# EAGLE design Fysetc F6_TMC-Shield_HV (EAGLE 8.6.3)
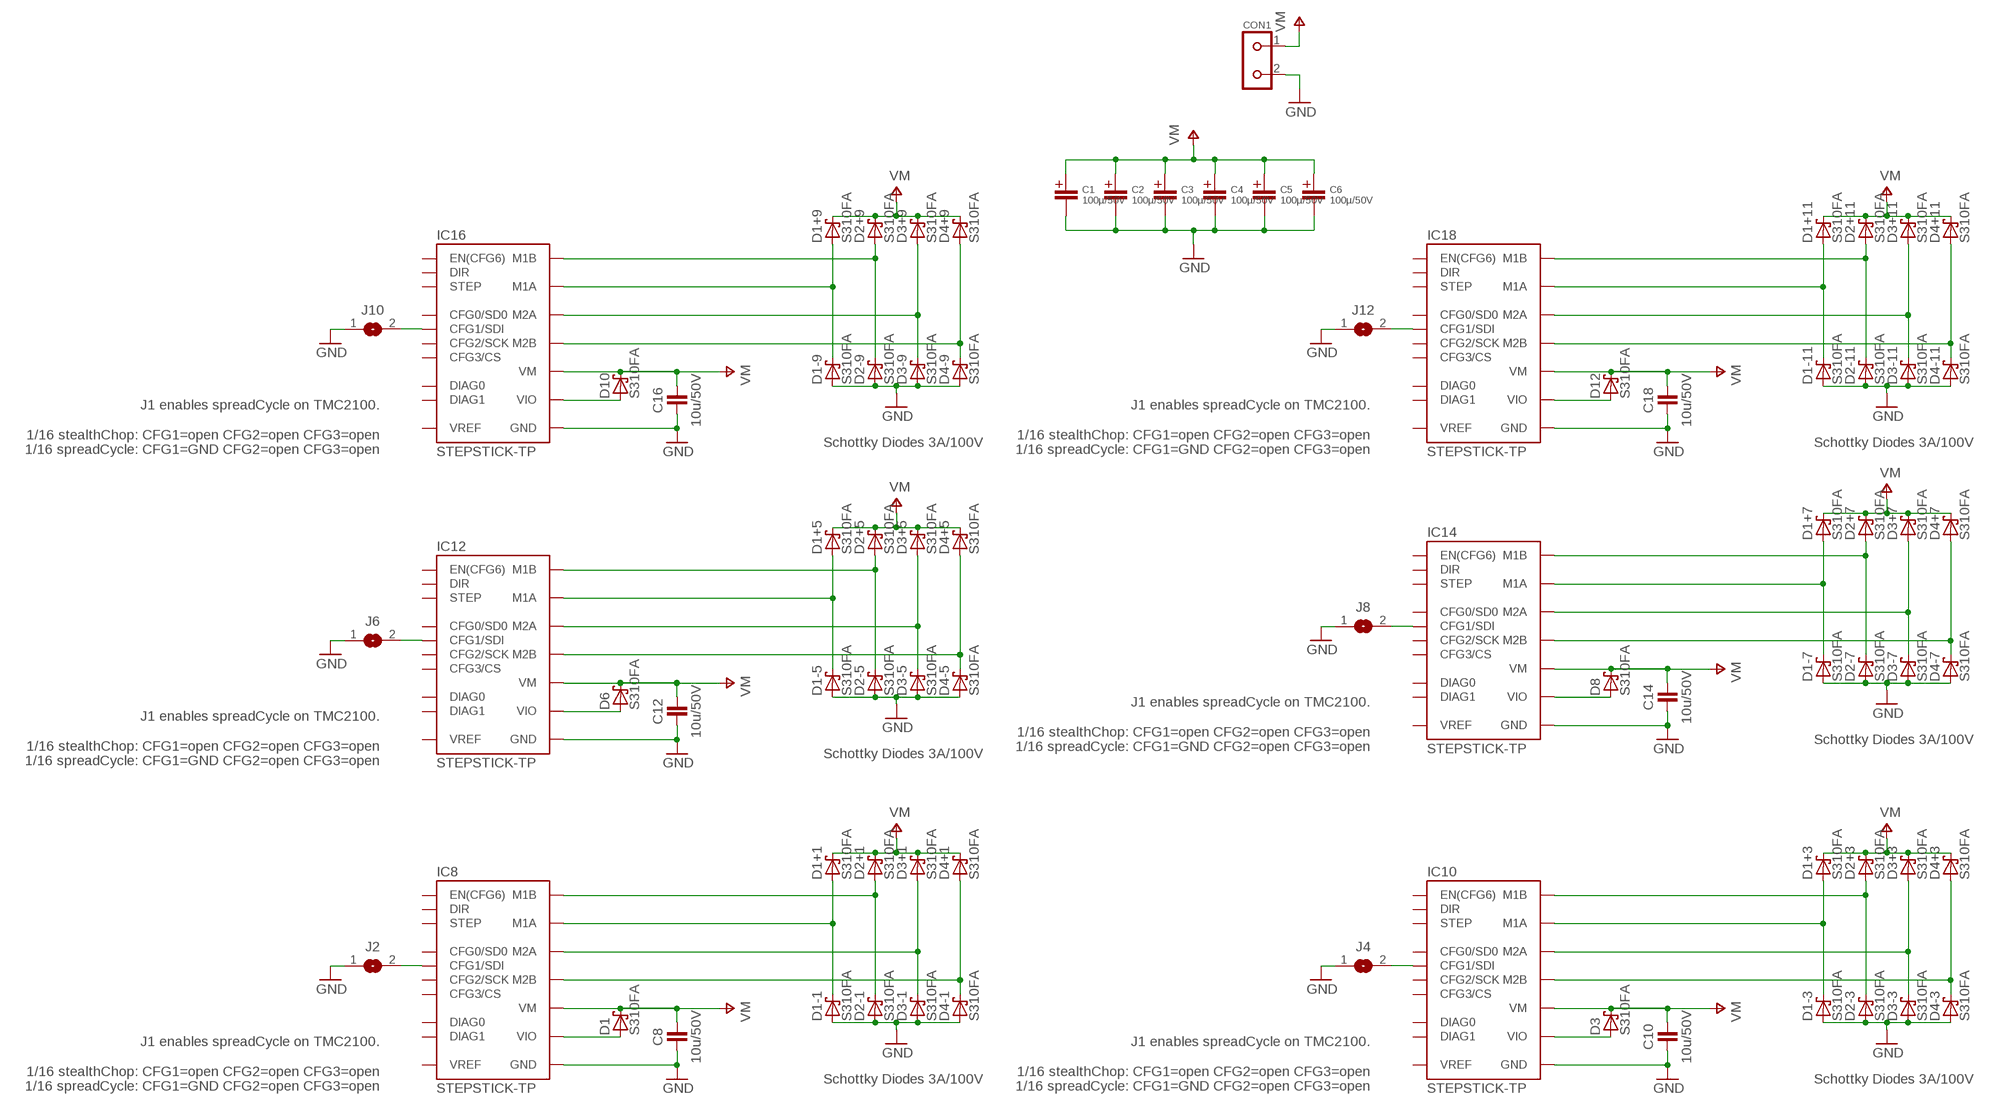
[diagram p0: schematic, sheet 1]

## Parts
C1  100µ/50V  C+3.5/8  [C+/3.5/8]
C2  100µ/50V  C+3.5/8  [C+/3.5/8]
C3  100µ/50V  C+3.5/8  [C+/3.5/8]
C4  100µ/50V  C+3.5/8  [C+/3.5/8]
C5  100µ/50V  C+3.5/8  [C+/3.5/8]
C6  100µ/50V  C+3.5/8  [C+/3.5/8]
C8  10u/50V  CAPACITOR-1210  [C1210]
C10  10u/50V  CAPACITOR-1210  [C1210]
C12  10u/50V  CAPACITOR-1210  [C1210]
C14  10u/50V  CAPACITOR-1210  [C1210]
C16  10u/50V  CAPACITOR-1210  [C1210]
C18  10u/50V  CAPACITOR-1210  [C1210]
CON1  KL2691311500002  [KL2-691311500002]
D1  S310FA  D_SCHOTTKY-SOD123  [SOD123]
D1+1  S310FA  D_SCHOTTKY-SOD123  [SOD123]
D1+3  S310FA  D_SCHOTTKY-SOD123  [SOD123]
D1+5  S310FA  D_SCHOTTKY-SOD123  [SOD123]
D1+7  S310FA  D_SCHOTTKY-SOD123  [SOD123]
D1+9  S310FA  D_SCHOTTKY-SOD123  [SOD123]
D1+11  S310FA  D_SCHOTTKY-SOD123  [SOD123]
D1-1  S310FA  D_SCHOTTKY-SOD123  [SOD123]
D1-3  S310FA  D_SCHOTTKY-SOD123  [SOD123]
D1-5  S310FA  D_SCHOTTKY-SOD123  [SOD123]
D1-7  S310FA  D_SCHOTTKY-SOD123  [SOD123]
D1-9  S310FA  D_SCHOTTKY-SOD123  [SOD123]
D1-11  S310FA  D_SCHOTTKY-SOD123  [SOD123]
D2+1  S310FA  D_SCHOTTKY-SOD123  [SOD123]
D2+3  S310FA  D_SCHOTTKY-SOD123  [SOD123]
D2+5  S310FA  D_SCHOTTKY-SOD123  [SOD123]
D2+7  S310FA  D_SCHOTTKY-SOD123  [SOD123]
D2+9  S310FA  D_SCHOTTKY-SOD123  [SOD123]
D2+11  S310FA  D_SCHOTTKY-SOD123  [SOD123]
D2-1  S310FA  D_SCHOTTKY-SOD123  [SOD123]
D2-3  S310FA  D_SCHOTTKY-SOD123  [SOD123]
D2-5  S310FA  D_SCHOTTKY-SOD123  [SOD123]
D2-7  S310FA  D_SCHOTTKY-SOD123  [SOD123]
D2-9  S310FA  D_SCHOTTKY-SOD123  [SOD123]
D2-11  S310FA  D_SCHOTTKY-SOD123  [SOD123]
D3  S310FA  D_SCHOTTKY-SOD123  [SOD123]
D3+1  S310FA  D_SCHOTTKY-SOD123  [SOD123]
D3+3  S310FA  D_SCHOTTKY-SOD123  [SOD123]
D3+5  S310FA  D_SCHOTTKY-SOD123  [SOD123]
D3+7  S310FA  D_SCHOTTKY-SOD123  [SOD123]
D3+9  S310FA  D_SCHOTTKY-SOD123  [SOD123]
D3+11  S310FA  D_SCHOTTKY-SOD123  [SOD123]
D3-1  S310FA  D_SCHOTTKY-SOD123  [SOD123]
D3-3  S310FA  D_SCHOTTKY-SOD123  [SOD123]
D3-5  S310FA  D_SCHOTTKY-SOD123  [SOD123]
D3-7  S310FA  D_SCHOTTKY-SOD123  [SOD123]
D3-9  S310FA  D_SCHOTTKY-SOD123  [SOD123]
D3-11  S310FA  D_SCHOTTKY-SOD123  [SOD123]
D4+1  S310FA  D_SCHOTTKY-SOD123  [SOD123]
D4+3  S310FA  D_SCHOTTKY-SOD123  [SOD123]
D4+5  S310FA  D_SCHOTTKY-SOD123  [SOD123]
D4+7  S310FA  D_SCHOTTKY-SOD123  [SOD123]
D4+9  S310FA  D_SCHOTTKY-SOD123  [SOD123]
D4+11  S310FA  D_SCHOTTKY-SOD123  [SOD123]
D4-1  S310FA  D_SCHOTTKY-SOD123  [SOD123]
D4-3  S310FA  D_SCHOTTKY-SOD123  [SOD123]
D4-5  S310FA  D_SCHOTTKY-SOD123  [SOD123]
D4-7  S310FA  D_SCHOTTKY-SOD123  [SOD123]
D4-9  S310FA  D_SCHOTTKY-SOD123  [SOD123]
D4-11  S310FA  D_SCHOTTKY-SOD123  [SOD123]
D6  S310FA  D_SCHOTTKY-SOD123  [SOD123]
D8  S310FA  D_SCHOTTKY-SOD123  [SOD123]
D10  S310FA  D_SCHOTTKY-SOD123  [SOD123]
D12  S310FA  D_SCHOTTKY-SOD123  [SOD123]
IC8  STEPSTICK-TP  [STEPSTICK_TP]
IC10  STEPSTICK-TP  [STEPSTICK_TP]
IC12  STEPSTICK-TP  [STEPSTICK_TP]
IC14  STEPSTICK-TP  [STEPSTICK_TP]
IC16  STEPSTICK-TP  [STEPSTICK_TP]
IC18  STEPSTICK-TP  [STEPSTICK_TP]
J2  JUMPER2-0603-NC  [JUMPER2-0603_NC]
J4  JUMPER2-0603-NC  [JUMPER2-0603_NC]
J6  JUMPER2-0603-NC  [JUMPER2-0603_NC]
J8  JUMPER2-0603-NC  [JUMPER2-0603_NC]
J10  JUMPER2-0603-NC  [JUMPER2-0603_NC]
J12  JUMPER2-0603-NC  [JUMPER2-0603_NC]

## Nets
GND: C1.- C2.- C3.- C4.- C5.- C6.- C8.1 C10.1 C12.1 C14.1 C16.1 C18.1 CON1.2 D1-1.A D1-3.A D1-5.A D1-7.A D1-9.A D1-11.A D2-1.A D2-3.A D2-5.A D2-7.A D2-9.A D2-11.A D3-1.A D3-3.A D3-5.A D3-7.A D3-9.A D3-11.A D4-1.A D4-3.A D4-5.A D4-7.A D4-9.A D4-11.A IC8.GND@1(GND) IC8.GND@2(GND) IC10.GND@1(GND) IC10.GND@2(GND) IC12.GND@1(GND) IC12.GND@2(GND) IC14.GND@1(GND) IC14.GND@2(GND) IC16.GND@1(GND) IC16.GND@2(GND) IC18.GND@1(GND) IC18.GND@2(GND) J2.1 J4.1 J6.1 J8.1 J10.1 J12.1
M1A1: D1+1.A D1-1.C IC8.M1A
M1A3: D1+3.A D1-3.C IC10.M1A
M1A5: D1+5.A D1-5.C IC12.M1A
M1A7: D1+7.A D1-7.C IC14.M1A
M1A9: D1+9.A D1-9.C IC16.M1A
M1A11: D1+11.A D1-11.C IC18.M1A
M1B1: D2+1.A D2-1.C IC8.M1B
M1B3: D2+3.A D2-3.C IC10.M1B
M1B5: D2+5.A D2-5.C IC12.M1B
M1B7: D2+7.A D2-7.C IC14.M1B
M1B9: D2+9.A D2-9.C IC16.M1B
M1B11: D2+11.A D2-11.C IC18.M1B
M2A1: D3+1.A D3-1.C IC8.M2A
M2A3: D3+3.A D3-3.C IC10.M2A
M2A5: D3+5.A D3-5.C IC12.M2A
M2A7: D3+7.A D3-7.C IC14.M2A
M2A9: D3+9.A D3-9.C IC16.M2A
M2A11: D3+11.A D3-11.C IC18.M2A
M2B1: D4+1.A D4-1.C IC8.M2B
M2B3: D4+3.A D4-3.C IC10.M2B
M2B5: D4+5.A D4-5.C IC12.M2B
M2B7: D4+7.A D4-7.C IC14.M2B
M2B9: D4+9.A D4-9.C IC16.M2B
M2B11: D4+11.A D4-11.C IC18.M2B
N$2: IC8.CFG1(CFG1/SDI) J2.2
N$4: IC10.CFG1(CFG1/SDI) J4.2
N$6: IC12.CFG1(CFG1/SDI) J6.2
N$8: IC14.CFG1(CFG1/SDI) J8.2
N$10: IC16.CFG1(CFG1/SDI) J10.2
N$12: IC18.CFG1(CFG1/SDI) J12.2
VIO1: D1.A IC8.VIO
VIO3: D3.A IC10.VIO
VIO5: D6.A IC12.VIO
VIO7: D8.A IC14.VIO
VIO9: D10.A IC16.VIO
VIO11: D12.A IC18.VIO
VM: C1.+ C2.+ C3.+ C4.+ C5.+ C6.+ C8.2 C10.2 C12.2 C14.2 C16.2 C18.2 CON1.1 D1+1.C D1+3.C D1+5.C D1+7.C D1+9.C D1+11.C D1.C D2+1.C D2+3.C D2+5.C D2+7.C D2+9.C D2+11.C D3+1.C D3+3.C D3+5.C D3+7.C D3+9.C D3+11.C D3.C D4+1.C D4+3.C D4+5.C D4+7.C D4+9.C D4+11.C D6.C D8.C D10.C D12.C IC8.VM IC10.VM IC12.VM IC14.VM IC16.VM IC18.VM
Unconnected: IC8.CFG2(CFG2/SCK) IC8.CFG3(CFG3/CS) IC8.DIAG0 IC8.DIAG1 IC8.DIR IC8.EN(EN(CFG6)) IC8.NC/CFG0(CFG0/SD0) IC8.STEP IC8.VREF IC10.CFG2(CFG2/SCK) IC10.CFG3(CFG3/CS) IC10.DIAG0 IC10.DIAG1 IC10.DIR IC10.EN(EN(CFG6)) IC10.NC/CFG0(CFG0/SD0) IC10.STEP IC10.VREF IC12.CFG2(CFG2/SCK) IC12.CFG3(CFG3/CS) IC12.DIAG0 IC12.DIAG1 IC12.DIR IC12.EN(EN(CFG6)) IC12.NC/CFG0(CFG0/SD0) IC12.STEP IC12.VREF IC14.CFG2(CFG2/SCK) IC14.CFG3(CFG3/CS) IC14.DIAG0 IC14.DIAG1 IC14.DIR IC14.EN(EN(CFG6)) IC14.NC/CFG0(CFG0/SD0) IC14.STEP IC14.VREF IC16.CFG2(CFG2/SCK) IC16.CFG3(CFG3/CS) IC16.DIAG0 IC16.DIAG1 IC16.DIR IC16.EN(EN(CFG6)) IC16.NC/CFG0(CFG0/SD0) IC16.STEP IC16.VREF IC18.CFG2(CFG2/SCK) IC18.CFG3(CFG3/CS) IC18.DIAG0 IC18.DIAG1 IC18.DIR IC18.EN(EN(CFG6)) IC18.NC/CFG0(CFG0/SD0) IC18.STEP IC18.VREF

## Notes on the sheet
- J1 enables spreadCycle on TMC2100.
  
  1/16 stealthChop: CFG1=open CFG2=open CFG3=open
  1/16 spreadCycle: CFG1=GND CFG2=open CFG3=open
- J1 enables spreadCycle on TMC2100.
  
  1/16 stealthChop: CFG1=open CFG2=open CFG3=open
  1/16 spreadCycle: CFG1=GND CFG2=open CFG3=open
- Schottky Diodes 3A/100V | Schottky Diodes 3A/100V
- J1 enables spreadCycle on TMC2100.
  
  1/16 stealthChop: CFG1=open CFG2=open CFG3=open
  1/16 spreadCycle: CFG1=GND CFG2=open CFG3=open
- J1 enables spreadCycle on TMC2100.
  
  1/16 stealthChop: CFG1=open CFG2=open CFG3=open
  1/16 spreadCycle: CFG1=GND CFG2=open CFG3=open
- Schottky Diodes 3A/100V
- Schottky Diodes 3A/100V
- J1 enables spreadCycle on TMC2100.
  
  1/16 stealthChop: CFG1=open CFG2=open CFG3=open
  1/16 spreadCycle: CFG1=GND CFG2=open CFG3=open
- J1 enables spreadCycle on TMC2100.
  
  1/16 stealthChop: CFG1=open CFG2=open CFG3=open
  1/16 spreadCycle: CFG1=GND CFG2=open CFG3=open
- Schottky Diodes 3A/100V | Schottky Diodes 3A/100V

## Library data of the parts
C1-C6 = goujine:C+
C8 C10 C12 C14 C16 C18 = we-rcl:CAPACITOR: Capacitors ...2.2uF @ 6.3V -> 0402 ...4.7uF @ 6.3V -> 0603 ...10uF @ 16V -> 0805 ...22uF @ 25V -> 1206
CON1 = neumluc:KL2: Printklemme 2-polig
D1 D1+1 D1+3 D1+5 D1+7 D1+9 D1+11 D1-1 D1-3 D1-5 D1-7 D1-9 D1-11 D2+1 D2+3 D2+5 D2+7 D2+9 D2+11 D2-1 D2-3 D2-5 D2-7 D2-9 D2-11 D3 D3+1 D3+3 D3+5 D3+7 D3+9 D3+11 D3-1 D3-3 D3-5 D3-7 D3-9 D3-11 D4+1 D4+3 D4+5 D4+7 D4+9 D4+11 D4-1 D4-3 D4-5 D4-7 D4-9 D4-11 D6 D8 D10 D12 = we-rcl:D_SCHOTTKY: Schottky Diodes 1A, 30V - SOD323 (BAS3010 or CUS10S40) 2A, 30V - SMA/DO214AC 10A,45V - Z5-T (CDBZ5T1045)
IC8 IC10 IC12 IC14 IC16 IC18 = we-board:STEPSTICK: SilentStepStick - Trinamic TMC2100/TMC2130 Stepper Motor Driver TMC2100 - CFG pins for configuration TMC2130 - SPI for configuration Pin CFG0/SDO only available on TMC2130 SilentStepStick.
J2 J4 J6 J8 J10 J12 = we-rcl:JUMPER2: 2 Pin Jumpers

## Board
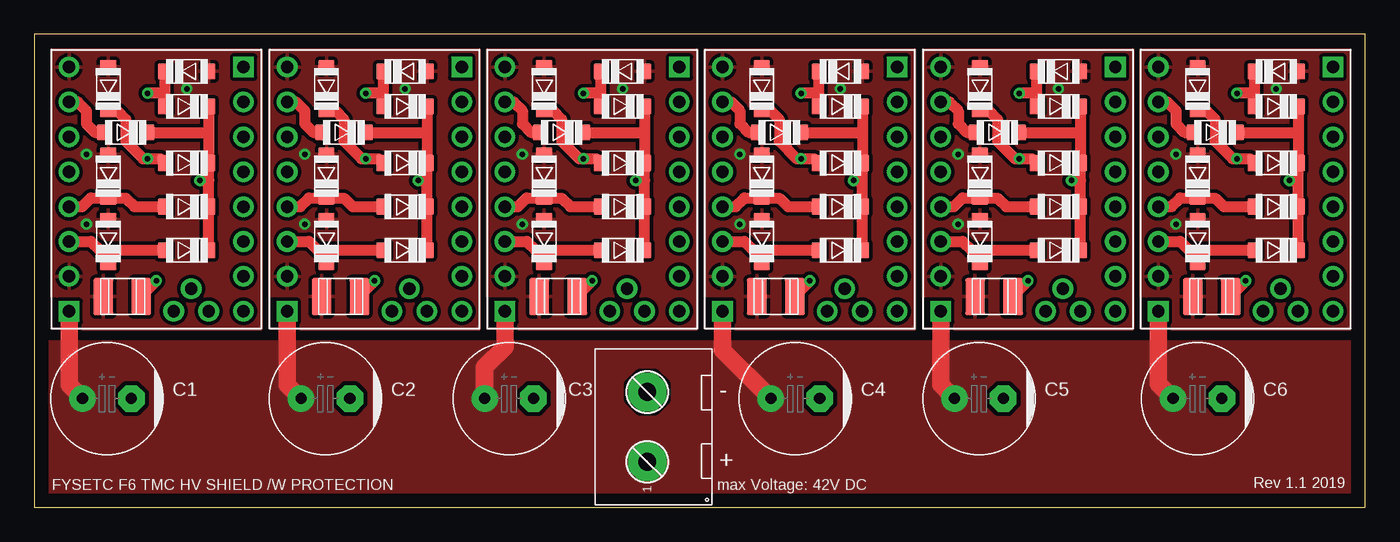
[diagram p1: board, top side]
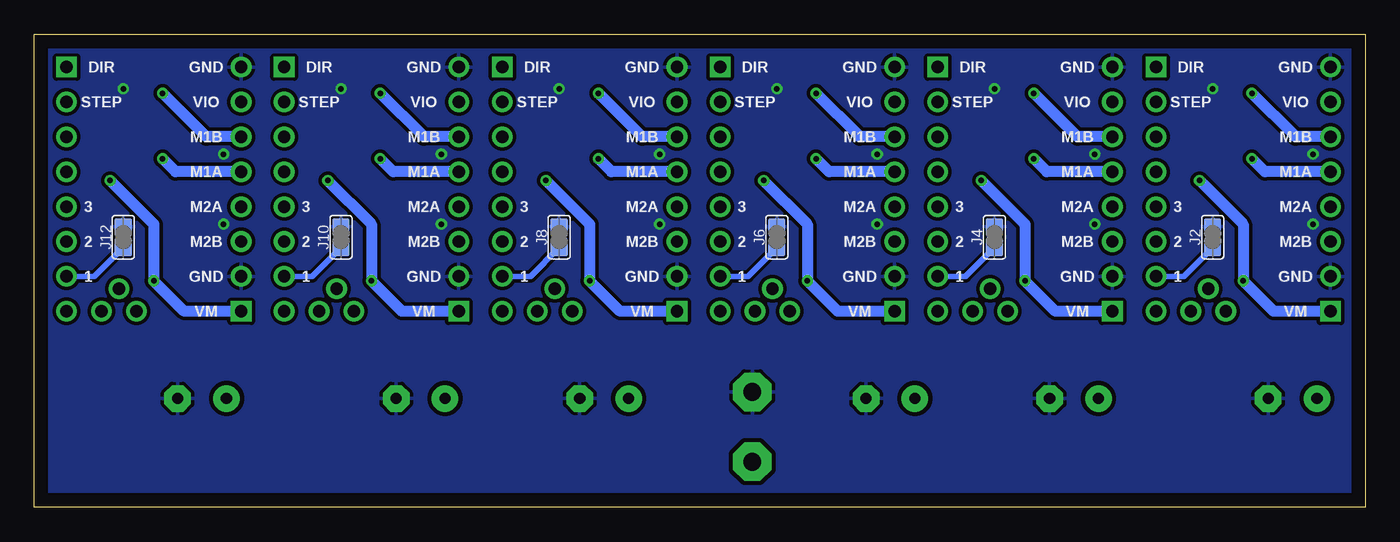
[diagram p2: board, bottom side, seen from below]

Size 96.82 x 34.44 mm. Coordinates in mm from the lower left corner, seen from the top.
Outline: 96.82,34.44 0,34.44 0,0 96.82,0 96.82,34.44
Copper layers (1*16): Top 0.035mm / dielectric 1.5mm / Bottom 0.035mm
Design rules "default": minimum track width 6mil, minimum drill 0.35mm, track to track 6mil, track to pad 6mil, pad to pad 6mil, via to via 6mil, smd to smd 6mil, copper to edge 40mil, drill to drill 6mil, minimum pad ring 10mil, minimum via ring 8mil, stop-mask expansion 4mil, vias tented up to drill 0mil, thermal gap 10mil
tRestrict: area 1.1,13 to 1.6,14.9; area 17.1,13 to 17.4,14.9; area 33,13 to 33.3,14.9; area 48.9,13 to 49.2,14.9; area 64.6,13 to 65.1,14.9; area 80.5,13 to 80.8,14.9

### Footprints (pad centres in the part's own frame; a part is rotated, then mirrored left to right if it is on the bottom)
C+/3.5/8 = drill 0.813 pad 1.93: + -1.778,0 | drill 0.813 pad 1.93 octagon: - 1.778,0
C1210 = smd 2.7 x 1.45: 1 0,1.4; 2 0,-1.35
KL2-691311500002 = drill 1.3 pad 2.8 octagon: 1 -2.54,0; 2 2.54,0
SOD123 = smd 1.2 x 1: A 0,-1.6; C 0,1.6
STEPSTICK_TP = drill 0.9 pad 1.5: CFG1 -6.35,6.35; CFG2 -6.35,3.81; CFG3 -6.35,1.27; DIAG0 -2.54,7.239; DIAG1 -1.27,8.89; EN -6.35,8.89; GND@1 6.35,6.35; GND@2 6.35,-8.89; M1A 6.35,-1.27; M1B 6.35,-3.81; M2A 6.35,1.27; M2B 6.35,3.81; NC -6.35,-3.81; NC/CFG0 -6.35,-1.27; STEP -6.35,-6.35; VIO 6.35,-6.35; VREF -3.81,8.89 | drill 0.9 pad 1.5 square: DIR -6.35,-8.89; VM 6.35,8.89
JUMPER2-0603_NC = smd 1.25 x 1.25: 1 0,0.76; 2 0,-0.76

### Placement (x,y rotation side)
C1  5.28,7.92 0 top
C2  21.18,7.92 0 top
C3  34.54,7.92 0 top
C4  55.36,7.92 0 top
C5  68.72,7.92 0 top
C6  84.62,7.92 0 top
C8  6.42,15.35 90 top
C10  22.3,15.35 90 top
C12  38.13,15.35 90 top
C14  53.97,15.35 90 top
C16  69.84,15.35 90 top
C18  85.68,15.35 90 top
CON1  44.59,5.86 90 top
D1  6.65,27.29 270 top
D1+1  11.09,25.07 270 top
D1+3  26.97,25.07 270 top
D1+5  42.8,25.07 270 top
D1+7  58.64,25.07 270 top
D1+9  74.51,25.07 270 top
D1+11  90.35,25.07 270 top
D1-1  5.38,30.47 180 top
D1-3  21.25,30.47 180 top
D1-5  37.09,30.47 180 top
D1-7  52.92,30.47 180 top
D1-9  68.8,30.47 180 top
D1-11  84.63,30.47 180 top
D2+1  11.09,29.2 270 top
D2+3  26.97,29.2 270 top
D2+5  42.8,29.2 270 top
D2+7  58.64,29.2 270 top
D2+9  74.51,29.2 270 top
D2+11  90.35,29.2 270 top
D2-1  11.09,31.74 90 top
D2-3  26.97,31.74 90 top
D2-5  42.8,31.74 90 top
D2-7  58.64,31.74 90 top
D2-9  74.51,31.74 90 top
D2-11  90.35,31.74 90 top
D3  22.52,27.29 270 top
D3+1  11.09,21.89 270 top
D3+3  26.97,21.89 270 top
D3+5  42.8,21.89 270 top
D3+7  58.64,21.89 270 top
D3+9  74.51,21.89 270 top
D3+11  90.35,21.89 270 top
D3-1  5.38,24.12 180 top
D3-3  21.25,24.12 180 top
D3-5  37.09,24.12 180 top
D3-7  52.92,24.12 180 top
D3-9  68.8,24.12 180 top
D3-11  84.63,24.12 180 top
D4+1  11.09,18.72 270 top
D4+3  26.97,18.72 270 top
D4+5  42.8,18.72 270 top
D4+7  58.64,18.72 270 top
D4+9  74.51,18.72 270 top
D4+11  90.35,18.72 270 top
D4-1  5.38,19.36 180 top
D4-3  21.25,19.36 180 top
D4-5  37.09,19.36 180 top
D4-7  52.92,19.36 180 top
D4-9  68.8,19.36 180 top
D4-11  84.63,19.36 180 top
D6  38.36,27.29 270 top
D8  54.19,27.29 270 top
D10  70.07,27.29 270 top
D12  85.9,27.29 270 top
IC8  8.87,23.16 180 top
IC10  24.75,23.16 180 top
IC12  40.58,23.16 180 top
IC14  56.42,23.16 180 top
IC16  72.29,23.16 180 top
IC18  88.13,23.16 180 top
J2  11.09,19.67 0 bottom
J4  26.97,19.67 0 bottom
J6  42.8,19.67 0 bottom
J8  58.64,19.67 0 bottom
J10  74.51,19.67 0 bottom
J12  90.35,19.67 0 bottom

### Tracks (layer width: path | path; a pad name or v marks a point on that pad's centre or on a via)
GND  (via drill 0.4)
  other vias: 11.09,30.47 3.79,20.62 3.79,25.71 26.97,30.47 19.66,20.62 19.66,25.71 42.8,30.47 35.5,20.62 35.5,25.71 58.64,30.47 51.34,20.62 51.34,25.71 74.51,30.47 67.21,20.62 67.21,25.71 90.35,30.47 83.05,20.62 83.05,25.71
  pour Bottom (isolate 0.254): 1.25,13.01 16.49,13.01 16.49,33.32 1.25,33.32
  pour Top (isolate 0.254): 1.25,13.01 16.49,13.01 16.49,33.32 1.25,33.32
  pour Bottom (isolate 0.254): 17.12,13.01 32.36,13.01 32.36,33.32 17.12,33.32
  pour Top (isolate 0.254): 17.12,13.01 32.36,13.01 32.36,33.32 17.12,33.32
  pour Bottom (isolate 0.254): 32.96,13.01 48.2,13.01 48.2,33.32 32.96,33.32
  pour Top (isolate 0.254): 32.96,13.01 48.2,13.01 48.2,33.32 32.96,33.32
  pour Bottom (isolate 0.254): 48.8,13.01 64.04,13.01 64.04,33.32 48.8,33.32
  pour Top (isolate 0.254): 48.8,13.01 64.04,13.01 64.04,33.32 48.8,33.32
  pour Bottom (isolate 0.254): 64.67,13.01 79.91,13.01 79.91,33.32 64.67,33.32
  pour Top (isolate 0.254): 64.67,13.01 79.91,13.01 79.91,33.32 64.67,33.32
  pour Bottom (isolate 0.254): 80.51,13.01 95.75,13.01 95.75,33.32 80.51,33.32
  pour Top (isolate 0.254): 80.51,13.01 95.75,13.01 95.75,33.32 80.51,33.32
  pour Bottom (isolate 0.305): -0.02,34.44 96.34,34.44 96.34,-0.01 -0.02,-0.01
M1A1  (via drill 0.4)
  Top 0.813: D1+1.A 9.49,25.08 9.19,25.39 v8.24,25.39 7.92,25.39 6.65,26.66 6.65,28.25 6.03,28.87 D1-1.C
  Bottom 0.813: IC8.M1A 7.28,24.44 v8.24,25.39
M1A3  (via drill 0.4)
  Top 0.813: D1+3.A 25.37,25.08 25.06,25.39 v24.11,25.39 23.79,25.39 22.52,26.66 22.52,28.25 21.9,28.87 D1-3.C
  Bottom 0.813: IC10.M1A 23.16,24.44 v24.11,25.39
M1A5  (via drill 0.4)
  Top 0.813: D1+5.A 41.2,25.08 40.9,25.39 v39.95,25.39 39.63,25.39 38.36,26.66 38.36,28.25 37.73,28.87 D1-5.C
  Bottom 0.813: IC12.M1A 38.99,24.44 v39.95,25.39
M1A7  (via drill 0.4)
  Top 0.813: D1+7.A 57.04,25.08 56.73,25.39 v55.78,25.39 55.46,25.39 54.19,26.66 54.19,28.25 53.57,28.87 D1-7.C
  Bottom 0.813: IC14.M1A 54.83,24.44 v55.78,25.39
M1A9  (via drill 0.4)
  Top 0.813: D1+9.A 72.91,25.08 72.61,25.39 v71.66,25.39 71.34,25.39 70.07,26.66 70.07,28.25 69.45,28.87 D1-9.C
  Bottom 0.813: IC16.M1A 70.7,24.44 v71.66,25.39
M1A11  (via drill 0.4)
  Top 0.813: D1+11.A 88.75,25.08 88.44,25.39 v87.49,25.39 87.17,25.39 85.9,26.66 85.9,28.25 85.28,28.87 D1-11.C
  Bottom 0.813: IC18.M1A 86.54,24.44 v87.49,25.39
M1B1  (via drill 0.4)
  Top 0.813: D2+1.A D2-1.C 9.49,30.15 v8.24,30.15
  Bottom 0.813: IC8.M1B 5.06,26.98 v8.24,30.15
M1B3  (via drill 0.4)
  Top 0.813: D2+3.A D2-3.C 25.37,30.15 v24.11,30.15
  Bottom 0.813: IC10.M1B 20.93,26.98 v24.11,30.15
M1B5  (via drill 0.4)
  Top 0.813: D2+5.A D2-5.C 41.2,30.15 v39.95,30.15
  Bottom 0.813: IC12.M1B 36.77,26.98 v39.95,30.15
M1B7  (via drill 0.4)
  Top 0.813: D2+7.A D2-7.C 57.04,30.15 v55.78,30.15
  Bottom 0.813: IC14.M1B 52.61,26.98 v55.78,30.15
M1B9  (via drill 0.4)
  Top 0.813: D2+9.A D2-9.C 72.91,30.15 v71.66,30.15
  Bottom 0.813: IC16.M1B 68.48,26.98 v71.66,30.15
M1B11  (via drill 0.4)
  Top 0.813: D2+11.A D2-11.C 88.75,30.15 v87.49,30.15
  Bottom 0.813: IC18.M1B 84.32,26.98 v87.49,30.15
M2A1
  Top 0.813: IC8.M2A 3.47,21.89 4.11,22.53 5.37,22.53 D3-1.C 6.66,22.52 7.28,21.89 D3+1.A
M2A3
  Top 0.813: IC10.M2A 19.35,21.89 19.98,22.53 21.24,22.53 D3-3.C 22.54,22.52 23.16,21.89 D3+3.A
M2A5
  Top 0.813: IC12.M2A 35.18,21.89 35.82,22.53 37.07,22.53 D3-5.C 38.37,22.52 38.99,21.89 D3+5.A
M2A7
  Top 0.813: IC14.M2A 51.02,21.89 51.65,22.53 52.91,22.53 D3-7.C 54.21,22.52 54.83,21.89 D3+7.A
M2A9
  Top 0.813: IC16.M2A 66.89,21.89 67.53,22.53 68.79,22.53 D3-9.C 70.08,22.52 70.7,21.89 D3+9.A
M2A11
  Top 0.813: IC18.M2A 82.73,21.89 83.36,22.53 84.62,22.53 D3-11.C 85.92,22.52 86.54,21.89 D3+11.A
M2B1
  Top 0.813: IC8.M2B 4.11,19.35 4.74,18.72 5.38,18.72 | 5.38,18.72 D4+1.A | D4-1.C 5.38,18.72
M2B3
  Top 0.813: IC10.M2B 19.98,19.35 20.62,18.72 21.25,18.72 | 21.25,18.72 D4+3.A | D4-3.C 21.25,18.72
M2B5
  Top 0.813: IC12.M2B 35.82,19.35 36.45,18.72 37.09,18.72 | 37.09,18.72 D4+5.A | D4-5.C 37.09,18.72
M2B7
  Top 0.813: IC14.M2B 51.65,19.35 52.29,18.72 52.92,18.72 | 52.92,18.72 D4+7.A | D4-7.C 52.92,18.72
M2B9
  Top 0.813: IC16.M2B 67.53,19.35 68.16,18.72 68.8,18.72 | 68.8,18.72 D4+9.A | D4-9.C 68.8,18.72
M2B11
  Top 0.813: IC18.M2B 83.36,19.35 84,18.72 84.63,18.72 | 84.63,18.72 D4+11.A | D4-11.C 84.63,18.72
N$2
  Bottom 0.406: IC8.CFG1 13.19,16.82 J2.2
N$4
  Bottom 0.406: IC10.CFG1 29.07,16.82 J4.2
N$6
  Bottom 0.406: IC12.CFG1 44.9,16.82 J6.2
N$8
  Bottom 0.406: IC14.CFG1 60.74,16.82 J8.2
N$10
  Bottom 0.406: IC16.CFG1 76.61,16.82 J10.2
N$12
  Bottom 0.406: IC18.CFG1 92.45,16.82 J12.2
VIO1
  Top 0.813: IC8.VIO 3.15,29.51 3.79,28.88 3.79,27.93 4.43,27.29 D1.A
VIO3
  Top 0.813: IC10.VIO 19.03,29.51 19.66,28.88 19.66,27.93 20.3,27.29 D3.A
VIO5
  Top 0.813: IC12.VIO 34.86,29.51 35.5,28.88 35.5,27.93 36.13,27.29 D6.A
VIO7
  Top 0.813: IC14.VIO 50.7,29.51 51.34,28.88 51.34,27.93 51.97,27.29 D8.A
VIO9
  Top 0.813: IC16.VIO 66.58,29.51 67.21,28.88 67.21,27.93 67.85,27.29 D10.A
VIO11
  Top 0.813: IC18.VIO 82.41,29.51 83.05,28.88 83.05,27.93 83.68,27.29 D12.A
VM  (via drill 0.4)
  Top 0.813: D2+1.C 12.69,27.29 | 12.69,27.29 D1+1.C 12.69,23.8 | D4+1.C D3+1.C 12.69,23.8 | v12.04,23.8 12.69,23.8 | 7.78,15.35 C8.2 7.77,15.4 v8.87,16.5 | D1.C 12.69,27.29 | D2+3.C 28.57,27.29 | 28.57,27.29 D1+3.C 28.57,23.8 | D4+3.C D3+3.C 28.57,23.8 | v27.92,23.8 28.57,23.8 | C10.2 23.65,15.4 v24.75,16.5 | D3.C 28.57,27.29 | D2+5.C 44.4,27.29 | 44.4,27.29 D1+5.C 44.4,23.8 | D4+5.C D3+5.C 44.4,23.8 | v43.75,23.8 44.4,23.8 | 39.49,15.35 C12.2 39.48,15.4 v40.58,16.5 | D6.C 44.4,27.29 | D2+7.C 60.24,27.29 | 60.24,27.29 D1+7.C 60.24,23.8 | D4+7.C D3+7.C 60.24,23.8 | v59.59,23.8 60.24,23.8 | C14.2 55.32,15.4 v56.42,16.5 | D8.C 60.24,27.29 | D2+9.C 76.11,27.29 | 76.11,27.29 D1+9.C 76.11,23.8 | D4+9.C D3+9.C 76.11,23.8 | v75.47,23.8 76.11,23.8 | 71.2,15.35 C16.2 71.2,15.4 v72.29,16.5 | D10.C 76.11,27.29 | D2+11.C 91.95,27.29 | 91.95,27.29 D1+11.C 91.95,23.8 | D4+11.C D3+11.C 91.95,23.8 | v91.3,23.8 91.95,23.8 | C18.2 87.03,15.4 v88.13,16.5 | D12.C 91.95,27.29
  Top 1.27: C1.+ 2.52,8.9 IC8.VM | C2.+ 18.39,8.93 IC10.VM | C3.+ 32.76,10.22 34.23,11.7 IC12.VM | C4.+ 50.07,11.44 IC14.VM | C5.+ 65.94,8.93 IC16.VM | C6.+ 81.78,8.99 IC18.VM
  Bottom 0.813: IC8.VM 6.65,14.27 v8.87,16.5 8.87,20.62 v12.04,23.8 | IC10.VM 22.52,14.27 v24.75,16.5 24.75,20.62 v27.92,23.8 | IC12.VM 38.36,14.27 v40.58,16.5 40.58,20.62 v43.75,23.8 | IC14.VM 54.19,14.27 v56.42,16.5 56.42,20.62 v59.59,23.8 | IC16.VM 70.07,14.27 v72.29,16.5 72.29,20.62 v75.47,23.8 | IC18.VM 85.9,14.27 v88.13,16.5 88.13,20.62 v91.3,23.8
  pour Top (isolate 0.305, no thermals): -0.02,-0.01 96.34,-0.01 96.34,12.05 -0.02,12.05

### Text on the board
bPlace: GND | DIR | GND | DIR | GND | DIR | GND | DIR | GND | DIR | GND | DIR | VIO | STEP | VIO | STEP | VIO | STEP | VIO | STEP | VIO | STEP | VIO | STEP | M1B | M1B | M1B | M1B | M1B | M1B | M1A | M1A | M1A | M1A | M1A | M1A | M2A | 3 | M2A | 3 | M2A | 3 | M2A | 3 | M2A | 3 | M2A | 3 | M2B | 2 | M2B | 2 | M2B | 2 | M2B | 2 | M2B | 2 | M2B | 2 | GND | 1 | GND | 1 | GND | 1 | GND | 1 | GND | 1 | GND | 1 | VM | VM | VM | VM | VM | VM
tNames: - | + | Rev 1.1 2019 | FYSETC F6 TMC HV SHIELD /W PROTECTION | max Voltage: 42V DC